# Altium schematic sheet 500_HEATERS.SchDoc: Heater Control
size A; Revision: 1; SheetNumber: 1
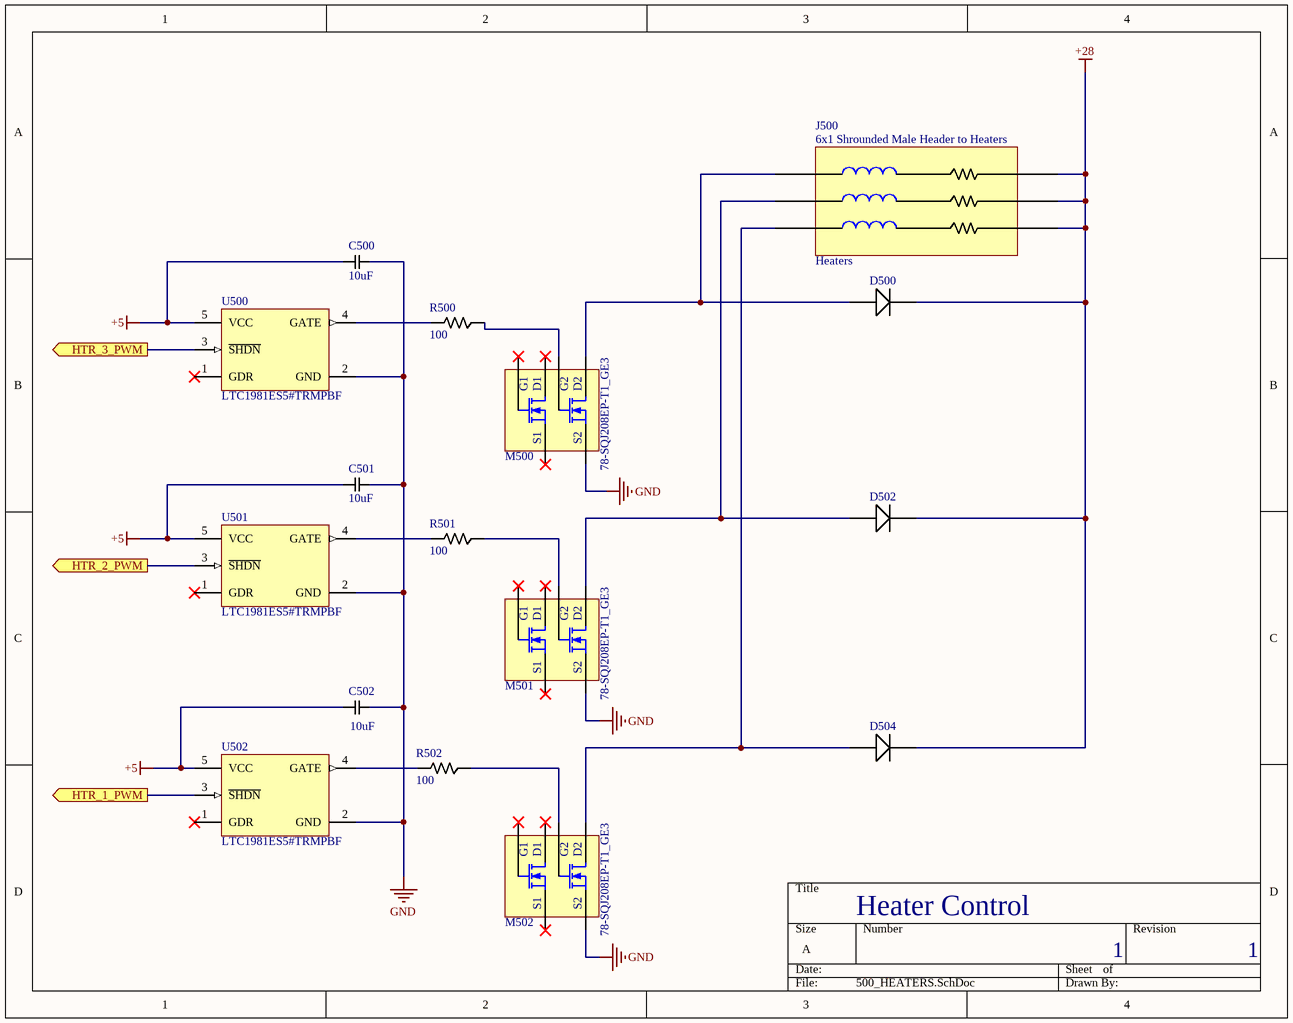
[diagram p0: 500_HEATERS.SchDoc]

## Parts
C500  value 10uF  [IMPERIAL0805_CAPACITOR]  (hidden comment: 10uF Capacitor)
C501  value 10uF  [IMPERIAL0805_CAPACITOR]  (hidden comment: 10uF Capacitor)
C502  value 10uF  [IMPERIAL0805_CAPACITOR]  (hidden comment: 10uF Capacitor)
D500  STPS1L40ZF  [*SODFL3718X108N]  (value not drawn)
D502  STPS1L40ZF  [*SODFL3718X108N]  (value not drawn)
D504  STPS1L40ZF  [*SODFL3718X108N]  (value not drawn)
J500  HeaterConnector  [MOLEX 6x1 latch header]  (value not drawn)
M500  Supplier Part Number 1: 78-SQJ208EP-T1_GE3  [PowerPAK SO-8L DUAL ASYMMETRIC]  (hidden comment: NPN MOSFET)
M501  Supplier Part Number 1: 78-SQJ208EP-T1_GE3  [PowerPAK SO-8L DUAL ASYMMETRIC]  (hidden comment: NPN MOSFET)
M502  Supplier Part Number 1: 78-SQJ208EP-T1_GE3  [PowerPAK SO-8L DUAL ASYMMETRIC]  (hidden comment: NPN MOSFET)
R500  value 100  [Imperial0603_RES]  (hidden comment: CRCW0603100RFKEAC)
R501  value 100  [Imperial0603_RES]  (hidden comment: CRCW0603100RFKEAC)
R502  value 100  [Imperial0603_RES]  (hidden comment: CRCW0603100RFKEAC)
U500  LTC1981ES5#TRMPBF  [LT-S5-5-SOT-23_M]
U501  LTC1981ES5#TRMPBF  [LT-S5-5-SOT-23_M]
U502  LTC1981ES5#TRMPBF  [LT-S5-5-SOT-23_M]

## Ports
HTR_1_PWM (out), HTR_2_PWM (out), HTR_3_PWM (out)

## Nets
+5: C500.2 C501.2 C502.2 U500.5(VCC) U501.5(VCC) U502.5(VCC)
+28: D500.1(cathode) D502.1(cathode) D504.1(cathode) J500.2 J500.4 J500.6
GND: C500.1 C501.1 C502.1 M500.S2 M501.S2 M502.S2 U500.2(GND) U501.2(GND) U502.2(GND)
HTR_1_PWM: U502.3(~{SHDN}) ; port HTR_1_PWM
HTR_2_PWM: U501.3(~{SHDN}) ; port HTR_2_PWM
HTR_3_PWM: U500.3(~{SHDN}) ; port HTR_3_PWM
NetD500_2: D500.2(anode) J500.1 M500.D2
NetD502_2: D502.2(anode) J500.3 M501.D2
NetD504_2: D504.2(anode) J500.5 M502.D2
NetM500_G2: M500.G2 R500.2
NetM501_G2: M501.G2 R501.2
NetM502_G2: M502.G2 R502.2
NetR500_1: R500.1 U500.4(GATE)
NetR501_1: R501.1 U501.4(GATE)
NetR502_1: R502.1 U502.4(GATE)

Not connected (* = marked no-connect by the designer): M500 D1* G1* S1*; M501 D1* G1* S1*; M502 D1* G1* S1*; U500 1(GDR)*; U501 1(GDR)*; U502 1(GDR)*

## Notes on the sheet
- (near J500) 6x1 Shrounded Male Header to Heaters
- (in symbol HeaterConnector) Heaters

## Library data of the parts
C500-C502 = C2012X8L1A106K125AE: 10 uF Capacitor; Supplier Part Number: C2012X8L1A106K125AE
D500 D502 D504 = STPS1L40ZF: 1A Schottky Diode; pin to pad: 1>C 2>A; Supplier 1: Mouser; Supplier Part Number 1: 511-STPS1L40ZF
J500 = HeaterConnector: Symbolic schematic symbol showing the inductance and resitance of the heaters
M500-M502 = SQJ208EP-T1_GE3: Two NPN Power Transistors for heater power control; Supplier 1: Mouser
R500-R502 = CRCW0603100RFKEAC: 100 Ohm Resistor; Supplier 1: Digi-Key; Supplier Part Number 1: 541-100HCT-ND
U500-U502 = CMP-0479-00408-1: Single and Dual Micropower High Side Switch Controller, 1.8 to 5.5 V Vin, 5-pin SOT23 (S5-5), -40 to 85 degC, Pb-Free, Mini Tape and Reel; Manufacturer: Analog Devices / Linear Technology; ComponentLink1URL: http://www.linear.com/; ComponentLink3Description: Package Specification; Packing: Mini Tape and Reel; PackageDescription: 5-Pin Plastic SOT-23, Body 1.625 x 2.90 mm, Pitch 0.95 mm; ComponentLink3URL: http://cds.linear.com/docs/en/datasheet/17278fb.pdf; PackageVersion: Aug-07; ComponentLink1Description: Manufacturer URL; PartNumber: LTC1981ES5#TRMPBF; RoHS: TRUE; ComponentLink2URL: http://cds.linear.com/docs/en/datasheet/19812fs.pdf; Mounting Technology: Surface Mount; PackageReference: S5-5; ComponentLink2Description: Datasheet; Manufacturer Part Number: LTC1981ES5#TRMPBF